# EAGLE design Grove - Tilt Switch v1.0 (EAGLE 5.10)
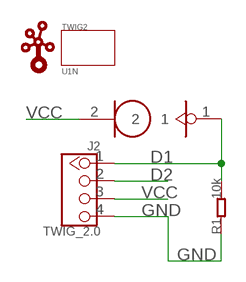
[diagram p0: schematic, sheet 1]

## Parts
J1  TILT  [TILT]
J2  TWIG_2.0  [2.0_1X4]
R1  10k  005-R0603  [0603]
TWIG2  U1N  [U1N]
U$1  TWIGLOGOTWIGLOGO_SMALL  [TWIGLOGO_SMALL]

## Nets
D1: J1.1 J2.1 R1.2
D2: J2.2
GND: J2.4 R1.1
VCC: J1.2 J2.3

## Library data of the parts
J1 = Seeed:TILT
J2 = CONNECTER:TWIG_2.0
R1 = Discrete:005-R*
TWIG2 = twig_template1:U1N
U$1 = seeedleo:TWIGLOGO

## Board
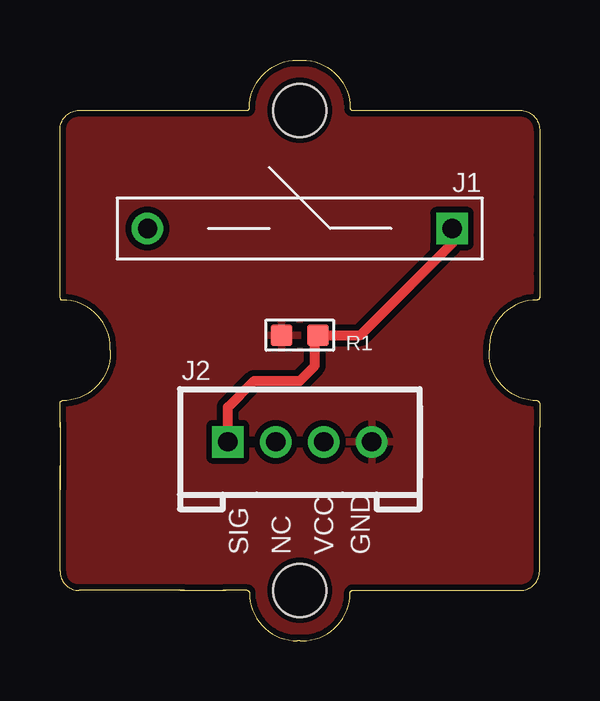
[diagram p1: board, top side]
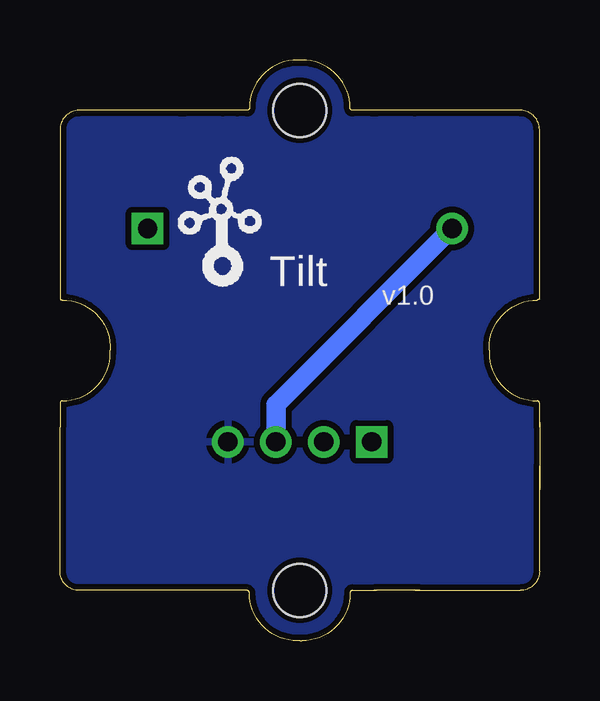
[diagram p2: board, bottom side, seen from below]

Size 20 x 24.2 mm. Coordinates in mm from the lower left corner, seen from the top.
Copper layers (1*16): Top 0.035mm / dielectric 1.5mm / Bottom 0.035mm
Design rules "SeeedStudio_rule_no_angle_090911": minimum track width 6mil, minimum drill 12mil, track to track 6mil, track to pad 6mil, pad to pad 6mil, via to via 6mil, smd to smd 0mil, copper to edge 10mil, drill to drill 10mil, minimum pad ring 10mil, minimum via ring 6mil, stop-mask expansion 2mil, vias tented up to drill 100mil, thermal gap 10mil

### Footprints (pad centres in the part's own frame; a part is rotated, then mirrored left to right if it is on the bottom)
TILT = drill 0.8 square: 1 0,0 | drill 0.8 round: 2 0,-12.7
2.0_1X4 = drill 0.8 pad 1.27 square: 1 -3,0 | drill 0.8 pad 1.27 round: 2 -1,0; 3 1,0; 4 3,0
0603 = smd 0.889 x 0.889: 1 -0.762,0; 2 0.762,0
U1N = hole 2.2: 0,-10; 0,10

### Placement (x,y rotation side)
J1  16.35,17.18 270 top
J2  10,8.29 0 top
R1  10,12.74 0 top
TWIG2  10,12.1 0 top
U$1  15.46,14.64 0 bottom

### Tracks (layer width: path | path; a pad name or v marks a point on that pad's centre or on a via)
D1
  Top 0.406: J1.1 16.35,16.55 12.54,12.74 R1.2 10.64,12.61 10.64,11.46 10,10.83 8.1,10.83 7,9.73 J2.1
GND
  pour Top (isolate 0.254): -0.29,25.18 20.29,25.18 20.29,-0.98 -0.29,-0.98
  pour Bottom (isolate 0.254): -0.29,25.18 20.29,25.18 20.54,-0.98 -0.03,-0.98
VCC
  Bottom 0.813: J2.3 11,9.83 J1.2

### Text on the board
tPlace: SIG | NC | VCC | GND
bPlace: Tilt | v1.0